# EAGLE design InstrumentationAmplifier (EAGLE 9.6.2)
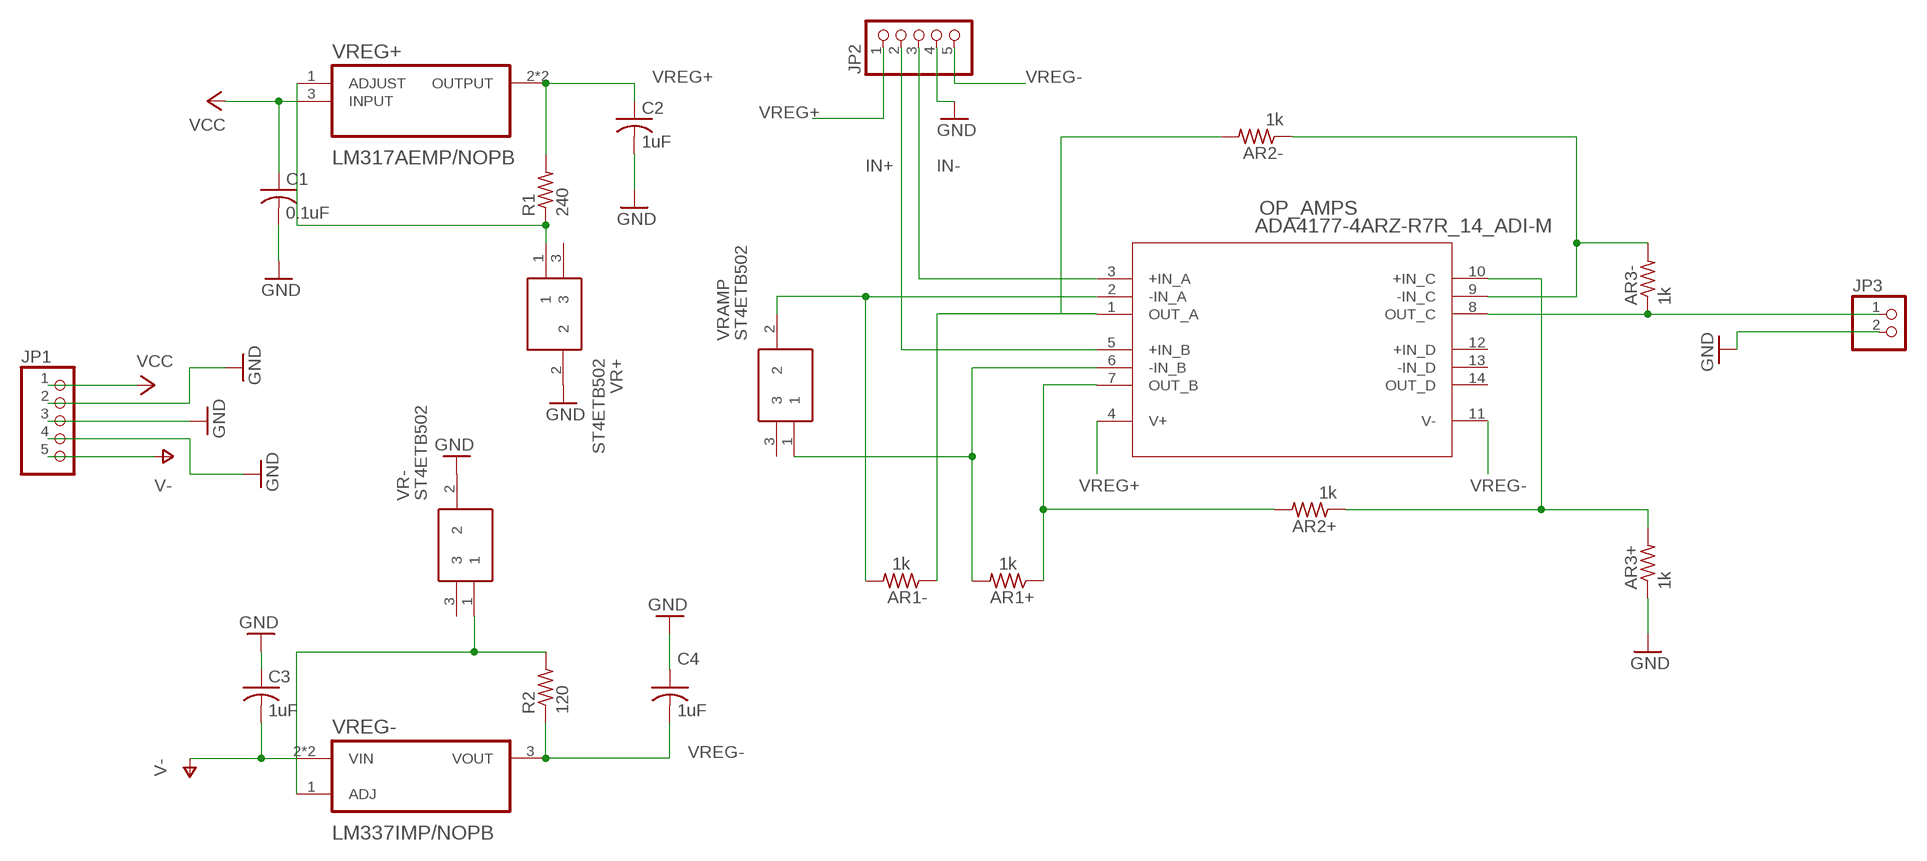
[diagram p0: schematic, sheet 1]

## Parts
AR1+  1k  R-US_R0603  [R0603]
AR1-  1k  R-US_R0603  [R0603]
AR2+  1k  R-US_R0603  [R0603]
AR2-  1k  R-US_R0603  [R0603]
AR3+  1k  R-US_R0603  [R0603]
AR3-  1k  R-US_R0603  [R0603]
C1  0.1uF  C-USC0603  [C0603]
C2  1uF  C-USC0603  [C0603]
C3  1uF  C-USC0603  [C0603]
C4  1uF  C-USC0603  [C0603]
JP1  PINHD-1X55X2MM  [1_05X2MM]
JP2  PINHD-1X55X2MM  [1_05X2MM]
JP3  PINHD-1X2  [1X02]
OP_AMPS  ADA4177-4ARZ-R7R_14_ADI-M  [R_14_ADI-M]
R1  240  R-US_R0603  [R0603]
R2  120  R-US_R0603  [R0603]
VR+  ST4ETB502  [ST-4EB]
VR-  ST4ETB502  [ST-4EB]
VRAMP  ST4ETB502  [ST-4EB]
VREG+  LM317AEMP/NOPB  [SOT230P700X180-4N]
VREG-  LM337IMP/NOPB  [SOT230P700X180-4N]

## Nets
GND: AR3+.1 C1.2 C2.2 C3.1 C4.1 JP1.2 JP1.3 JP1.4 JP2.4 JP3.2 VR+.2 VR-.2
IN+: JP2.2 OP_AMPS.5(+IN_B)
IN-: JP2.3 OP_AMPS.3(+IN_A)
N$1: AR2+.1 AR3+.2 OP_AMPS.10(+IN_C)
N$2: R1.1 VR+.1 VREG+.1(ADJUST)
N$3: AR2-.1 AR3-.2 OP_AMPS.9(-IN_C)
N$4: R2.2 VR-.1 VREG-.1(ADJ)
N$5: AR1-.1 AR2-.2 OP_AMPS.1(OUT_A)
N$6: AR1-.2 OP_AMPS.2(-IN_A) VRAMP.2
N$7: AR1+.1 AR2+.2 OP_AMPS.7(OUT_B)
N$8: AR1+.2 OP_AMPS.6(-IN_B) VRAMP.1
N$9: AR3-.1 JP3.1 OP_AMPS.8(OUT_C)
V-: C3.2 JP1.5 VREG-.2(VIN) VREG-.4(VIN)
VCC: C1.1 JP1.1 VREG+.3(INPUT)
VREG+: C2.1 JP2.1 OP_AMPS.4(V+) R1.2 VREG+.2(OUTPUT) VREG+.4(OUTPUT)
VREG-: C4.2 JP2.5 OP_AMPS.11(V-) R2.1 VREG-.3(VOUT)
Unconnected: OP_AMPS.12(+IN_D) OP_AMPS.13(-IN_D) OP_AMPS.14(OUT_D) VR+.3 VR-.3 VRAMP.3

## Library data of the parts
AR1+ AR1- AR2+ AR2- AR3+ AR3- R1 R2 = rcl:R-US_: RESISTOR, American symbol; SPICEPREFIX: R
C1-C4 = rcl:C-US: CAPACITOR, American symbol; SPICEPREFIX: C
JP1 JP2 = pinhead:PINHD-1X5: PIN HEADER
JP3 = pinhead:PINHD-1X2: PIN HEADER
OP_AMPS = OpAmpADA4177-4:ADA4177-4ARZ-R7; BUILT_BY: EMA_UL_Team; MANUFACTURER_PART_NUMBER: ADA4177-4ARZ-R7; SOURCELIBRARY: Analog_2016-09-28; VENDOR: Analog Devices Inc
VR+ VR- VRAMP = ST4ETB502:ST4ETB502: TRIMMER 5K OHM 0.25W GW TOP ADJ Source: Datasheet <https://www.nidec-copal-electronics.com/e/catalog/trimmer/st-4.pdf>; DESCRIPTION: TRIMMER 5K OHM 0.25W GW TOP ADJ; HEIGHT: mm; MANUFACTURER_NAME: Copal Electronics; MANUFACTURER_PART_NUMBER: ST4ETB502
VREG+ = LM317AEMP_NOPB:LM317AEMP/NOPB; DESCRIPTION: 1.5-A, 40-V, adjustable linear voltage regulator with high-accuracy 4-SOT-223 -40 to 125; DIGI-KEY_PART_NUMBER: LM317AEMPCT-ND; MF: Texas Instruments; MP: LM317AEMP; PACKAGE: SOT-223-4 Texas Instruments; PURCHASE-URL: https://pricing.snapeda.com/search/part/LM317AEMP/?ref=eda
VREG- = LM337IMP_NOPB:LM337IMP/NOPB; DESCRIPTION: 1.5-A, negative, adjustable linear voltage regulator 4-SOT-223 -40 to 125; DIGI-KEY_PART_NUMBER: LM337IMPCT-ND; MF: Texas Instruments; MP: LM337IMP; PACKAGE: SOT-223-4 Texas Instruments; PURCHASE-URL: https://pricing.snapeda.com/search/part/LM337IMP/?ref=eda

## Net classes
0 default: width 0.305 mm, drill 0.508 mm, clearance 0.254 mm

## Board
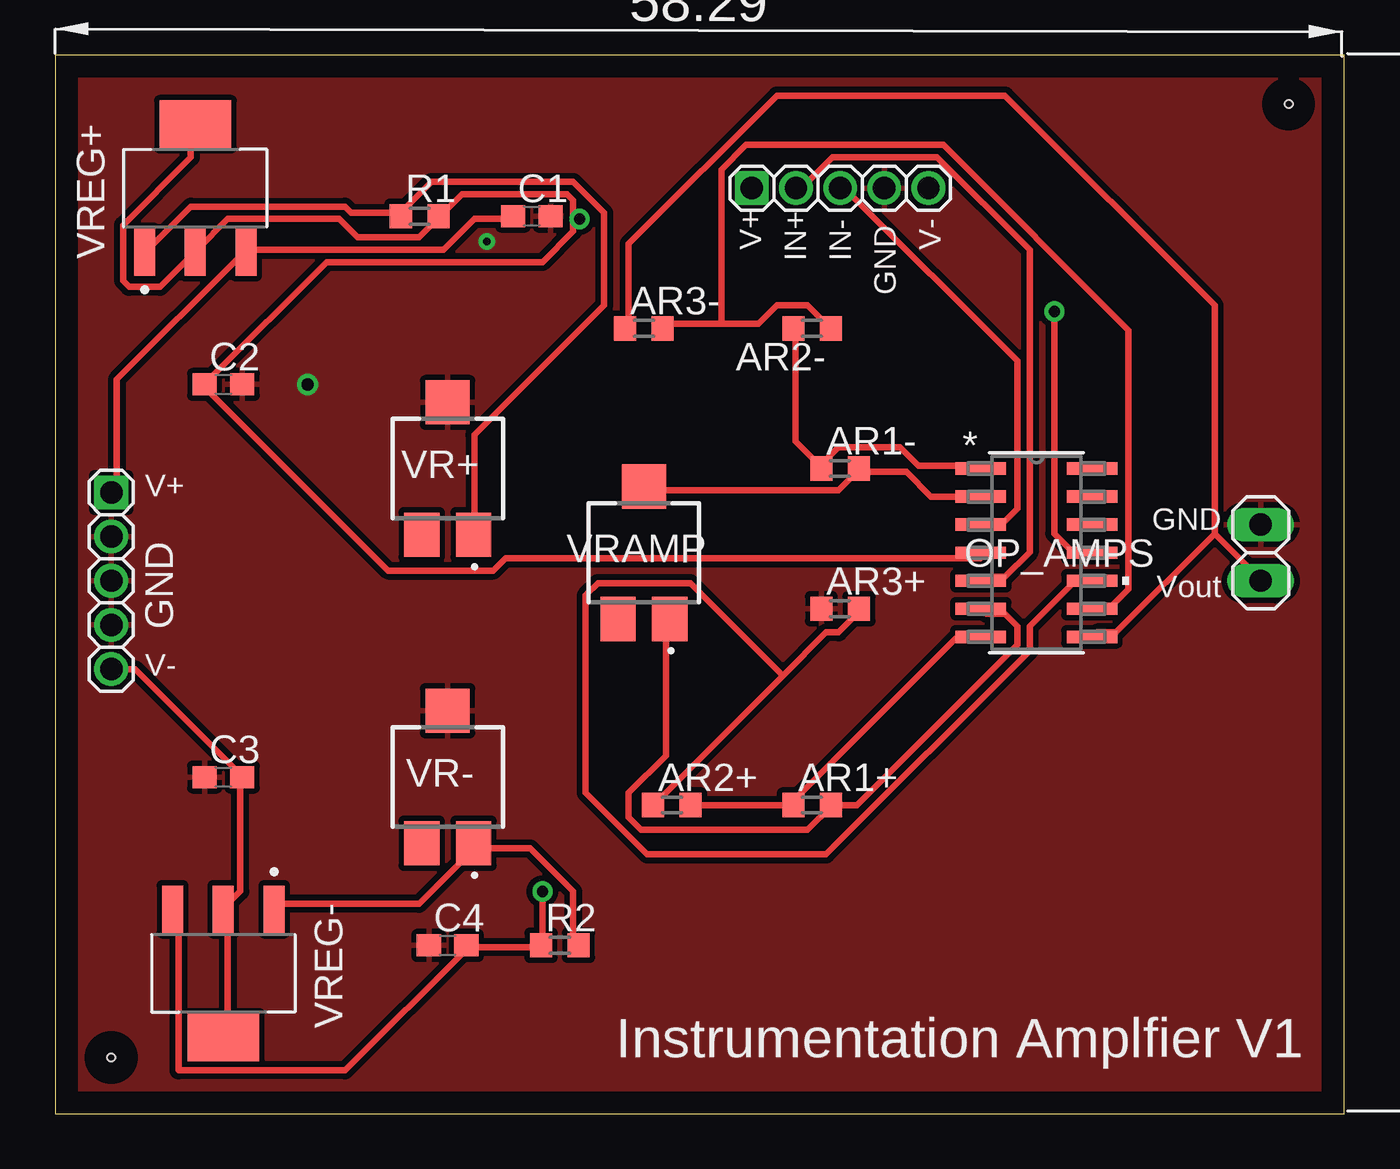
[diagram p1: board, top side]
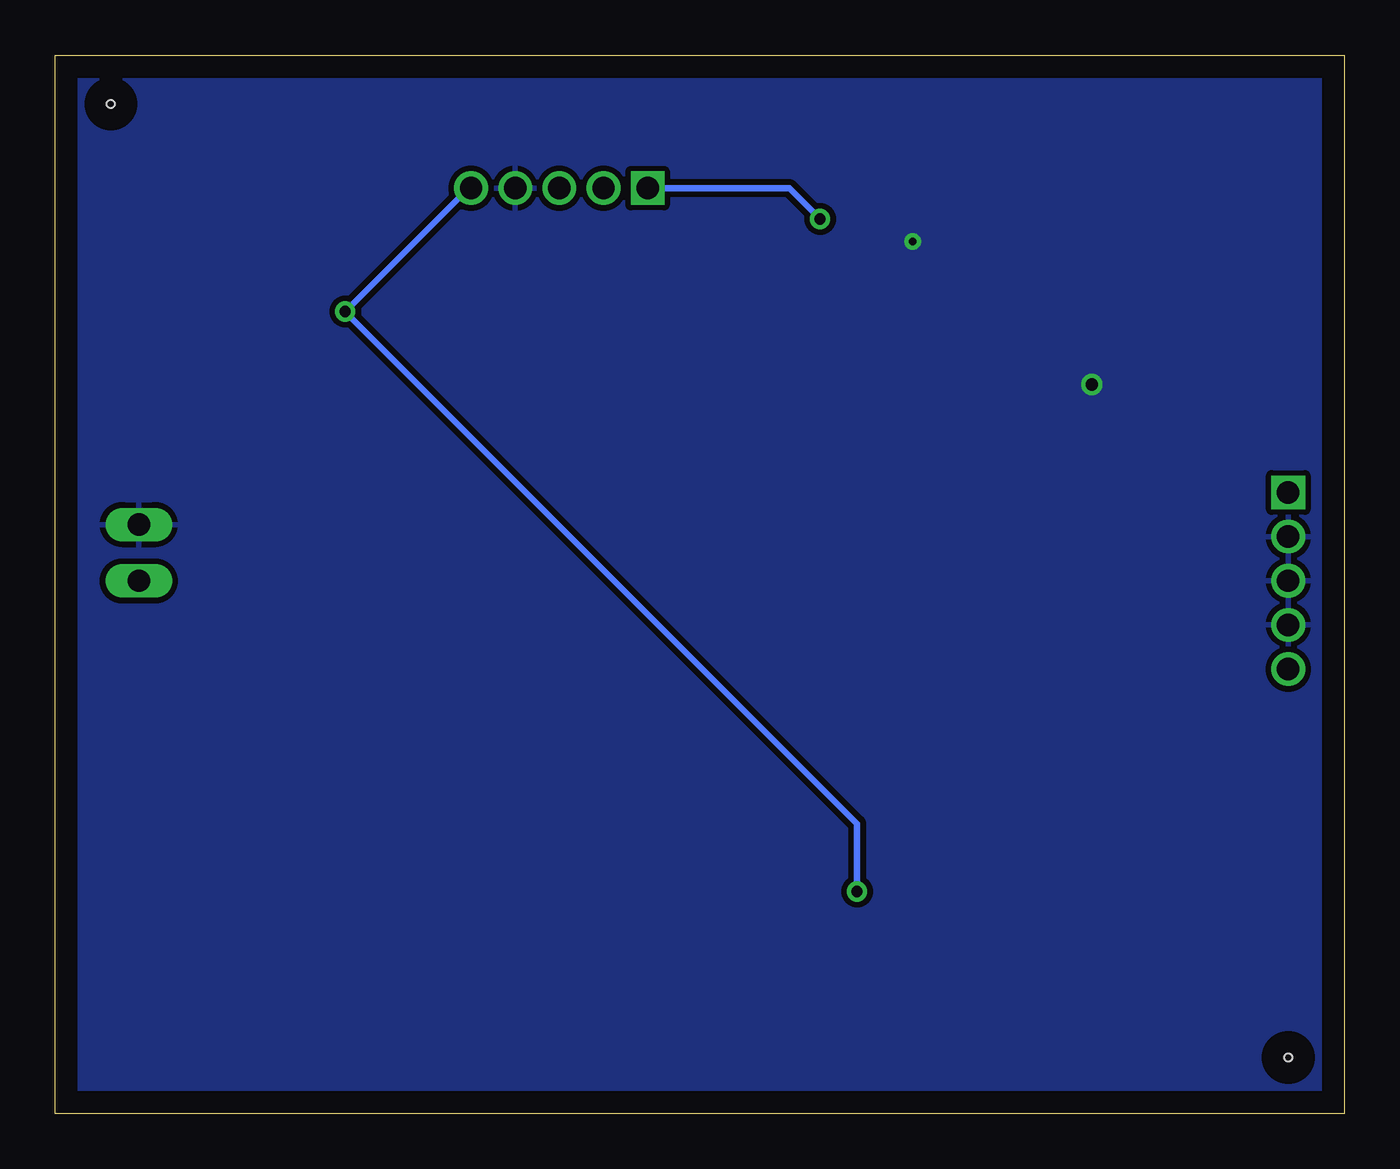
[diagram p2: board, bottom side, seen from below]

Size 58.4 x 47.93 mm. Coordinates in mm from the lower left corner, seen from the top.
Outline: 0,0 58.4,0 58.4,47.93 0,47.93 0,0
Copper layers (1*16): Top 0.035mm / dielectric 1.5mm / Bottom 0.035mm
Design rules "default": minimum track width 6mil, minimum drill 0.35mm, track to track 6mil, track to pad 6mil, pad to pad 6mil, via to via 6mil, smd to smd 6mil, copper to edge 40mil, drill to drill 6mil, minimum pad ring 10mil, minimum via ring 8mil, stop-mask expansion 4mil, vias tented up to drill 0mil, thermal gap 10mil
Holes 0.35 mm at 2.54,2.54 55.88,45.72

### Footprints (pad centres in the part's own frame; a part is rotated, then mirrored left to right if it is on the bottom)
R0603 = smd 1 x 1.1: 1 -0.85,0; 2 0.85,0
C0603 = smd 1.1 x 1: 1 -0.85,0; 2 0.85,0
1_05X2MM = drill 1.016 pad 1.3 square: 1 -4,0 | drill 1.016 pad 1.3: 2 -2,0; 3 0,0; 4 2,0; 5 4,0
1X02 = drill 1.016 long: 1 -1.27,0; 2 1.27,0
R_14_ADI-M = smd 2.286 x 0.559: 1 -2.515,3.81; 2 -2.515,2.54; 3 -2.515,1.27; 4 -2.515,0; 5 -2.515,-1.27; 6 -2.515,-2.54; 7 -2.515,-3.81; 8 2.515,-3.81; 9 2.515,-2.54; 10 2.515,-1.27; 11 2.515,0; 12 2.515,1.27; 13 2.515,2.54; 14 2.515,3.81
ST-4EB = smd 1.6 x 2: 1 1.175,-3; 3 -1.175,-3 | smd 2 x 2: 2 0,3
SOT230P700X180-4N = smd 2.15 x 0.95: 1 -2.9,2.3; 2 -2.9,0; 3 -2.9,-2.3 | smd 2.15 x 3.25: 4 2.9,0

### Placement (x,y rotation side)
AR1+  34.29,13.97 0 top
AR1-  35.56,29.21 0 top
AR2+  27.94,13.97 0 top
AR2-  34.29,35.56 180 top
AR3+  35.56,22.86 0 top
AR3-  26.67,35.56 0 top
C1  21.59,40.64 0 top
C2  7.62,33.02 0 top
C3  7.62,15.24 0 top
C4  17.78,7.62 0 top
JP1  2.54,24.13 270 top
JP2  35.56,41.91 0 top
JP3  54.61,25.4 90 top
OP_AMPS  44.45,25.4 0 top
R1  16.51,40.64 0 top
R2  22.86,7.62 0 top
VR+  17.78,29.21 0 top
VR-  17.78,15.24 0 top
VRAMP  26.67,25.4 0 top
VREG+  6.35,41.91 90 top
VREG-  7.62,6.35 270 top

### Tracks (layer width: path | path; a pad name or v marks a point on that pad's centre or on a via)
GND  (via drill 0.35, 0.55)
  Top 0.305: C1.2 22.63,40.51 22.52,40.56
  other vias: 11.43,33.02 19.56,39.5
  pour Top: -1.27,49.53 59.69,49.53 59.69,-1.27 -1.27,-1.27
  pour Bottom: -1.27,49.53 59.69,49.53 60.96,48.26 60.96,-1.27 -1.27,-1.27
IN+
  Top 0.305: OP_AMPS.5 42.19,24.31 43.03,24.31 44.15,25.43 44.15,39.12 39.95,43.31 35.2,43.31 33.81,41.91 JP2.2
IN-
  Top 0.305: OP_AMPS.3 42.19,26.82 43.03,26.82 43.59,27.38 43.59,34.09 35.76,41.91 JP2.3
N$1
  Top 0.305: 32.97,19.84 34.92,21.79 35.48,21.79 36.32,22.63 AR3+.2 | 32.97,19.84 27.1,13.97 AR2+.1 | 32.97,19.84 28.78,24.03 24.59,24.03 24.03,23.47 24.03,14.53 26.82,11.73 34.92,11.73 44.15,20.95 44.15,22.07 46.1,24.03 46.94,24.03 OP_AMPS.10
N$2
  Top 0.305: 15.65,40.79 13.41,40.79 13.13,41.07 6.15,41.07 4.19,39.12 VREG+.1 | 15.65,40.79 17.04,42.19 23.47,42.19 24.87,40.79 24.87,36.6 19,30.73 19,26.26 VR+.1 | 15.65,40.79 R1.1
N$3
  Top 0.305: 30.18,35.76 31.85,35.76 32.69,36.6 34.09,36.6 34.92,35.76 AR2-.1 | 30.18,35.76 27.66,35.76 AR3-.2 | 30.18,35.76 30.18,42.75 31.29,43.87 40.23,43.87 48.62,35.48 48.62,23.75 47.78,22.91 47.22,22.91 OP_AMPS.9
N$4
  Top 0.305: 19,12.01 21.51,12.01 23.47,10.06 23.47,7.82 R2.2 | 19,12.01 16.48,9.5 10.06,9.5 VREG-.1 | 19,12.01 VR-.1
N$5
  Top 0.305: 34.65,29.34 33.53,30.45 33.53,35.48 AR2-.2 | 34.65,29.34 35.48,30.18 38.28,30.18 39.12,29.34 41.91,29.34 OP_AMPS.1 | 34.65,29.34 AR1-.1
N$6
  Top 0.305: OP_AMPS.2 39.67,27.94 38.56,29.06 36.6,29.06 AR1-.2 36.32,29.06 35.48,28.22 26.82,28.22 VRAMP.2
N$7
  Top 0.305: 33.25,13.97 AR2+.2 | 33.25,13.97 40.79,21.51 41.91,21.51 OP_AMPS.7 | 33.25,13.97 AR1+.1
N$8
  Top 0.305: 35.2,13.97 36.32,13.97 43.59,21.23 43.59,22.07 43.03,22.63 42.19,22.63 OP_AMPS.6 | 35.2,13.97 34.09,12.85 26.54,12.85 25.98,13.41 25.98,14.53 27.66,16.2 27.66,22.35 VRAMP.1 | 35.2,13.97 AR1+.2
N$9
  Top 0.305: 52.53,26.26 52.53,36.6 43.03,46.1 32.69,46.1 25.98,39.4 25.98,35.76 AR3-.1 | 52.53,26.26 54.48,24.31 JP3.1 | 52.53,26.26 48.06,21.79 47.22,21.79 OP_AMPS.8
V-
  Top 0.305: JP1.5 2.79,20.12 3.63,20.12 8.38,15.37 C3.2 8.38,15.09 8.38,10.06 7.82,9.5 VREG-.2 7.82,9.22 7.82,3.63 VREG-.4
VCC
  Top 0.305: C1.1 20.68,40.51 19,40.51 17.6,39.12 8.66,39.12 VREG+.3 8.38,38.84 2.79,33.25 2.79,28.22 JP1.1
VREG+  (via drill 0.51)
  Top 0.305: 23.47,40.51 23.47,41.35 23.19,41.63 18.44,41.63 17.6,40.79 R1.2 17.32,40.51 16.48,39.67 13.69,39.67 12.85,40.51 7.82,40.51 6.43,39.12 VREG+.2 6.15,38.84 4.75,37.44 3.35,37.44 3.07,37.72 3.07,40.23 6.15,43.31 6.15,44.7 VREG+.4 | 23.47,40.51 23.47,39.95 22.07,38.56 12.29,38.56 6.99,33.25 C2.1 6.71,32.97 15.09,24.59 19.84,24.59 20.4,25.15 41.91,25.15 OP_AMPS.4 | 23.47,40.51 v23.75,40.51
  Bottom 0.305: JP2.1 25.15,41.91 v23.75,40.51
VREG-  (via drill 0.51)
  Top 0.305: 18.72,7.54 21.79,7.54 R2.1 22.07,7.82 v22.07,10.06 | 18.72,7.54 13.13,1.96 5.59,1.96 5.59,9.22 VREG-.3 | 18.72,7.54 C4.2 | v45.26,36.32 45.26,26.26 46.1,25.43 46.94,25.43 OP_AMPS.11
  Bottom 0.305: JP2.5 39.67,41.91 v45.26,36.32 22.07,13.13 v22.07,10.06

### Text on the board
tPlace: V+ | IN+ | IN- | V- | GND | V+ | GND | GND | Vout | V- | Instrumentation Amplfier V1